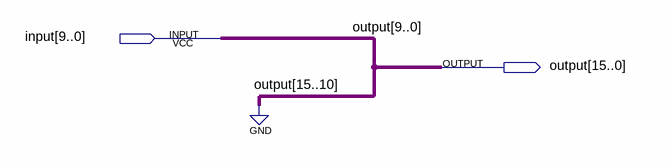
[diagram p0: schematic sheet]
// Quartus schematic extend10to16.bdf as structural Verilog: 0 symbols, 2 pins
module extend10to16 (
  input  [9:0] \input ,
  output [15:0] \output 
);


  assign \output  = {{6{1'b0}}, \input };
endmodule
